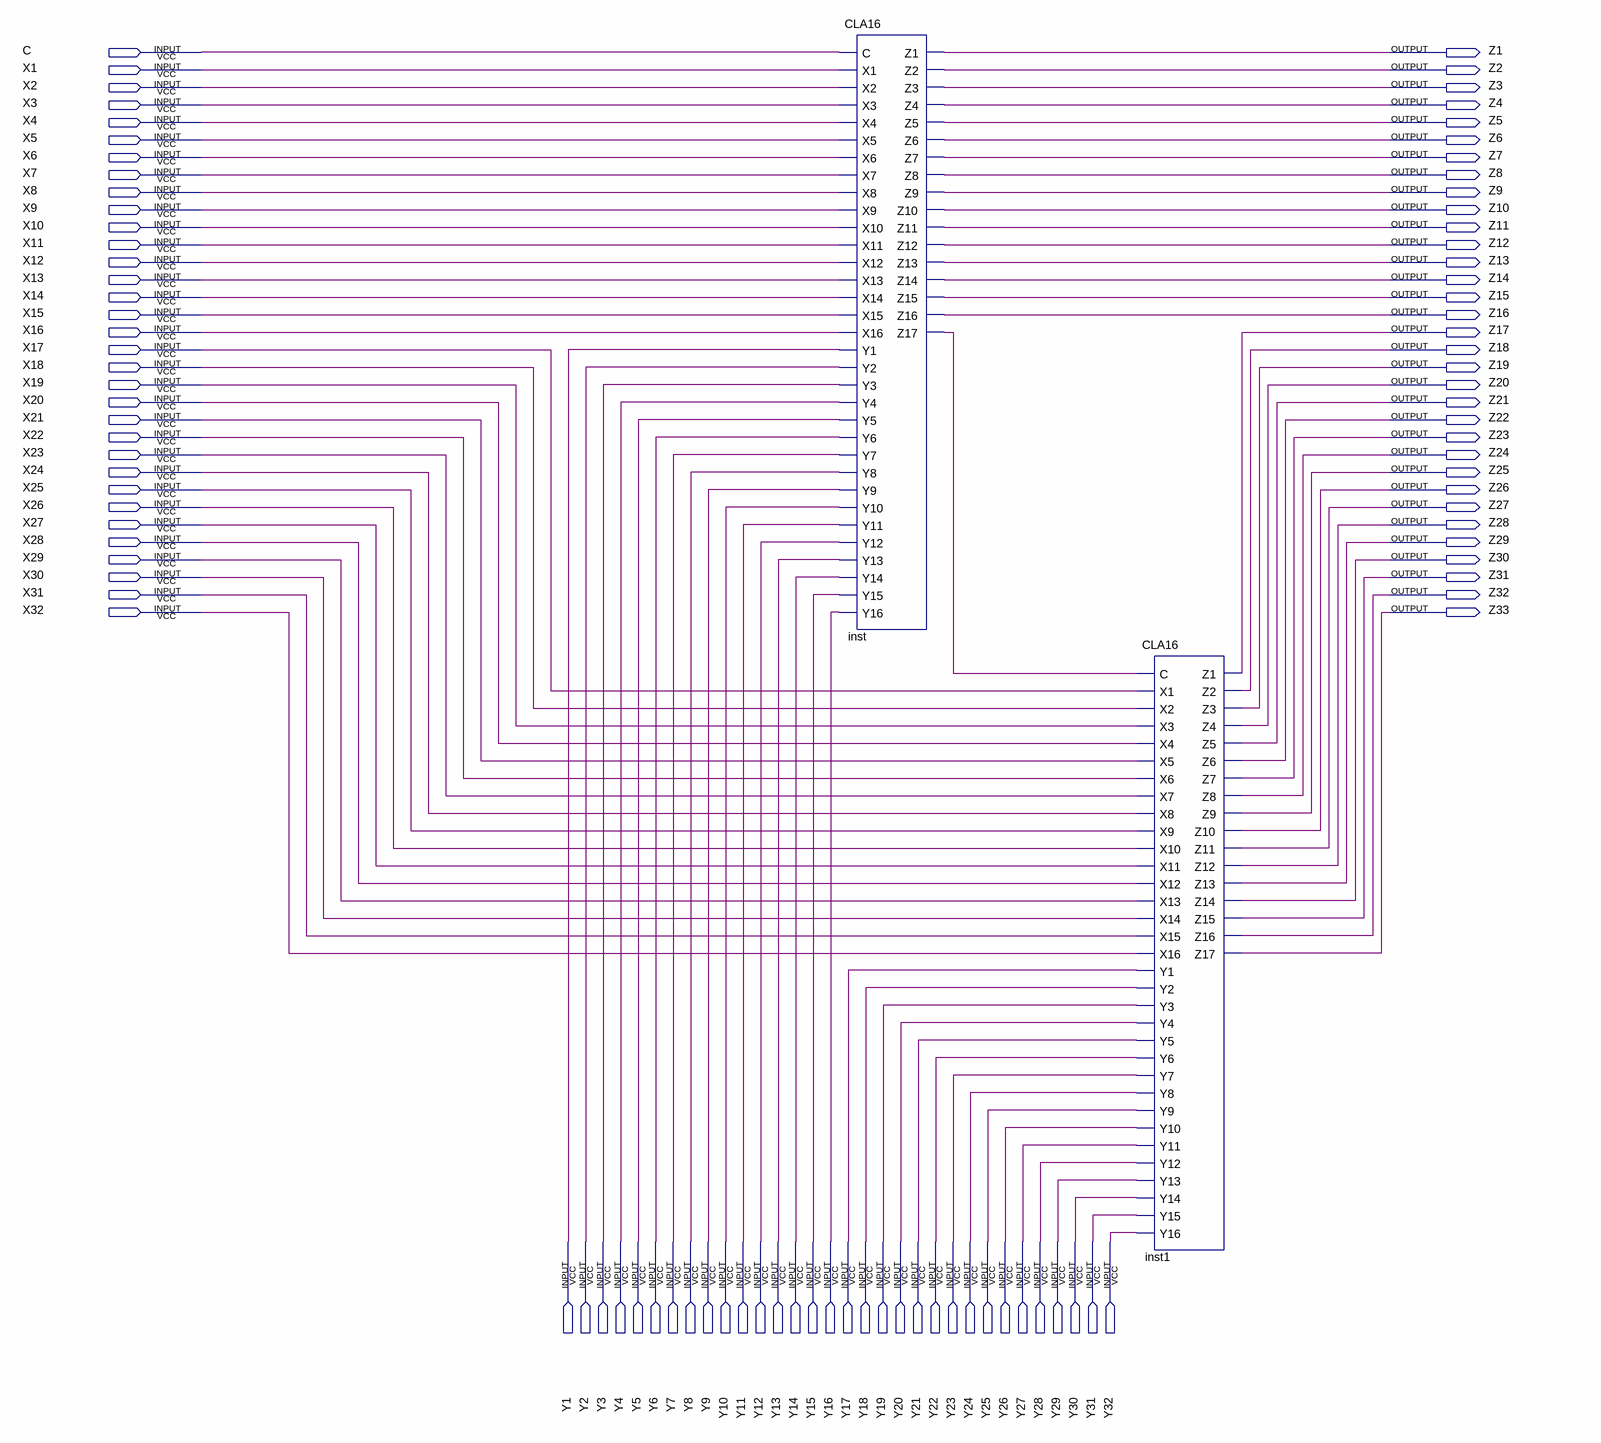
[diagram p0: schematic sheet]
// Quartus schematic CLA32.bdf as structural Verilog: 2 symbols, 98 pins
module CLA32 (
  input  C,
  input  X1,
  input  X2,
  input  X3,
  input  X4,
  input  X5,
  input  X6,
  input  X7,
  input  X8,
  input  X9,
  input  X10,
  input  X11,
  input  X12,
  input  X13,
  input  X14,
  input  X15,
  input  X16,
  input  X17,
  input  X18,
  input  X19,
  input  X20,
  input  X21,
  input  X22,
  input  X23,
  input  X24,
  input  X25,
  input  X26,
  input  X27,
  input  X28,
  input  X29,
  input  X30,
  input  X31,
  input  X32,
  input  Y1,
  input  Y2,
  input  Y3,
  input  Y4,
  input  Y5,
  input  Y6,
  input  Y7,
  input  Y8,
  input  Y9,
  input  Y10,
  input  Y11,
  input  Y12,
  input  Y13,
  input  Y14,
  input  Y15,
  input  Y16,
  input  Y17,
  input  Y18,
  input  Y19,
  input  Y20,
  input  Y21,
  input  Y22,
  input  Y23,
  input  Y24,
  input  Y25,
  input  Y26,
  input  Y27,
  input  Y28,
  input  Y29,
  input  Y30,
  input  Y31,
  input  Y32,
  output Z1,
  output Z2,
  output Z3,
  output Z4,
  output Z5,
  output Z6,
  output Z7,
  output Z8,
  output Z9,
  output Z10,
  output Z11,
  output Z12,
  output Z13,
  output Z14,
  output Z15,
  output Z16,
  output Z17,
  output Z18,
  output Z19,
  output Z20,
  output Z21,
  output Z22,
  output Z23,
  output Z24,
  output Z25,
  output Z26,
  output Z27,
  output Z28,
  output Z29,
  output Z30,
  output Z31,
  output Z32,
  output Z33
);

  wire inst_z17;

  CLA16 inst (
    .C(C), .X1(X1), .X2(X2), .X3(X3), .X4(X4), .X5(X5), .X6(X6), .X7(X7), .X8(X8), .X9(X9), .X10(X10),
    .X11(X11), .X12(X12), .X13(X13), .X14(X14), .X15(X15), .X16(X16), .Y1(Y1), .Y2(Y2), .Y3(Y3), .Y4(Y4),
    .Y5(Y5), .Y6(Y6), .Y7(Y7), .Y8(Y8), .Y9(Y9), .Y10(Y10), .Y11(Y11), .Y12(Y12), .Y13(Y13), .Y14(Y14),
    .Y15(Y15), .Y16(Y16), .Z1(Z1), .Z2(Z2), .Z3(Z3), .Z4(Z4), .Z5(Z5), .Z6(Z6), .Z7(Z7), .Z8(Z8), .Z9(Z9),
    .Z10(Z10), .Z11(Z11), .Z12(Z12), .Z13(Z13), .Z14(Z14), .Z15(Z15), .Z16(Z16), .Z17(inst_z17));
  CLA16 inst1 (
    .C(inst_z17), .X1(X17), .X2(X18), .X3(X19), .X4(X20), .X5(X21), .X6(X22), .X7(X23), .X8(X24), .X9(X25),
    .X10(X26), .X11(X27), .X12(X28), .X13(X29), .X14(X30), .X15(X31), .X16(X32), .Y1(Y17), .Y2(Y18),
    .Y3(Y19), .Y4(Y20), .Y5(Y21), .Y6(Y22), .Y7(Y23), .Y8(Y24), .Y9(Y25), .Y10(Y26), .Y11(Y27), .Y12(Y28),
    .Y13(Y29), .Y14(Y30), .Y15(Y31), .Y16(Y32), .Z1(Z17), .Z2(Z18), .Z3(Z19), .Z4(Z20), .Z5(Z21), .Z6(Z22),
    .Z7(Z23), .Z8(Z24), .Z9(Z25), .Z10(Z26), .Z11(Z27), .Z12(Z28), .Z13(Z29), .Z14(Z30), .Z15(Z31),
    .Z16(Z32), .Z17(Z33));
endmodule
